# EAGLE design MTCH_bob (EAGLE 9.6.2)
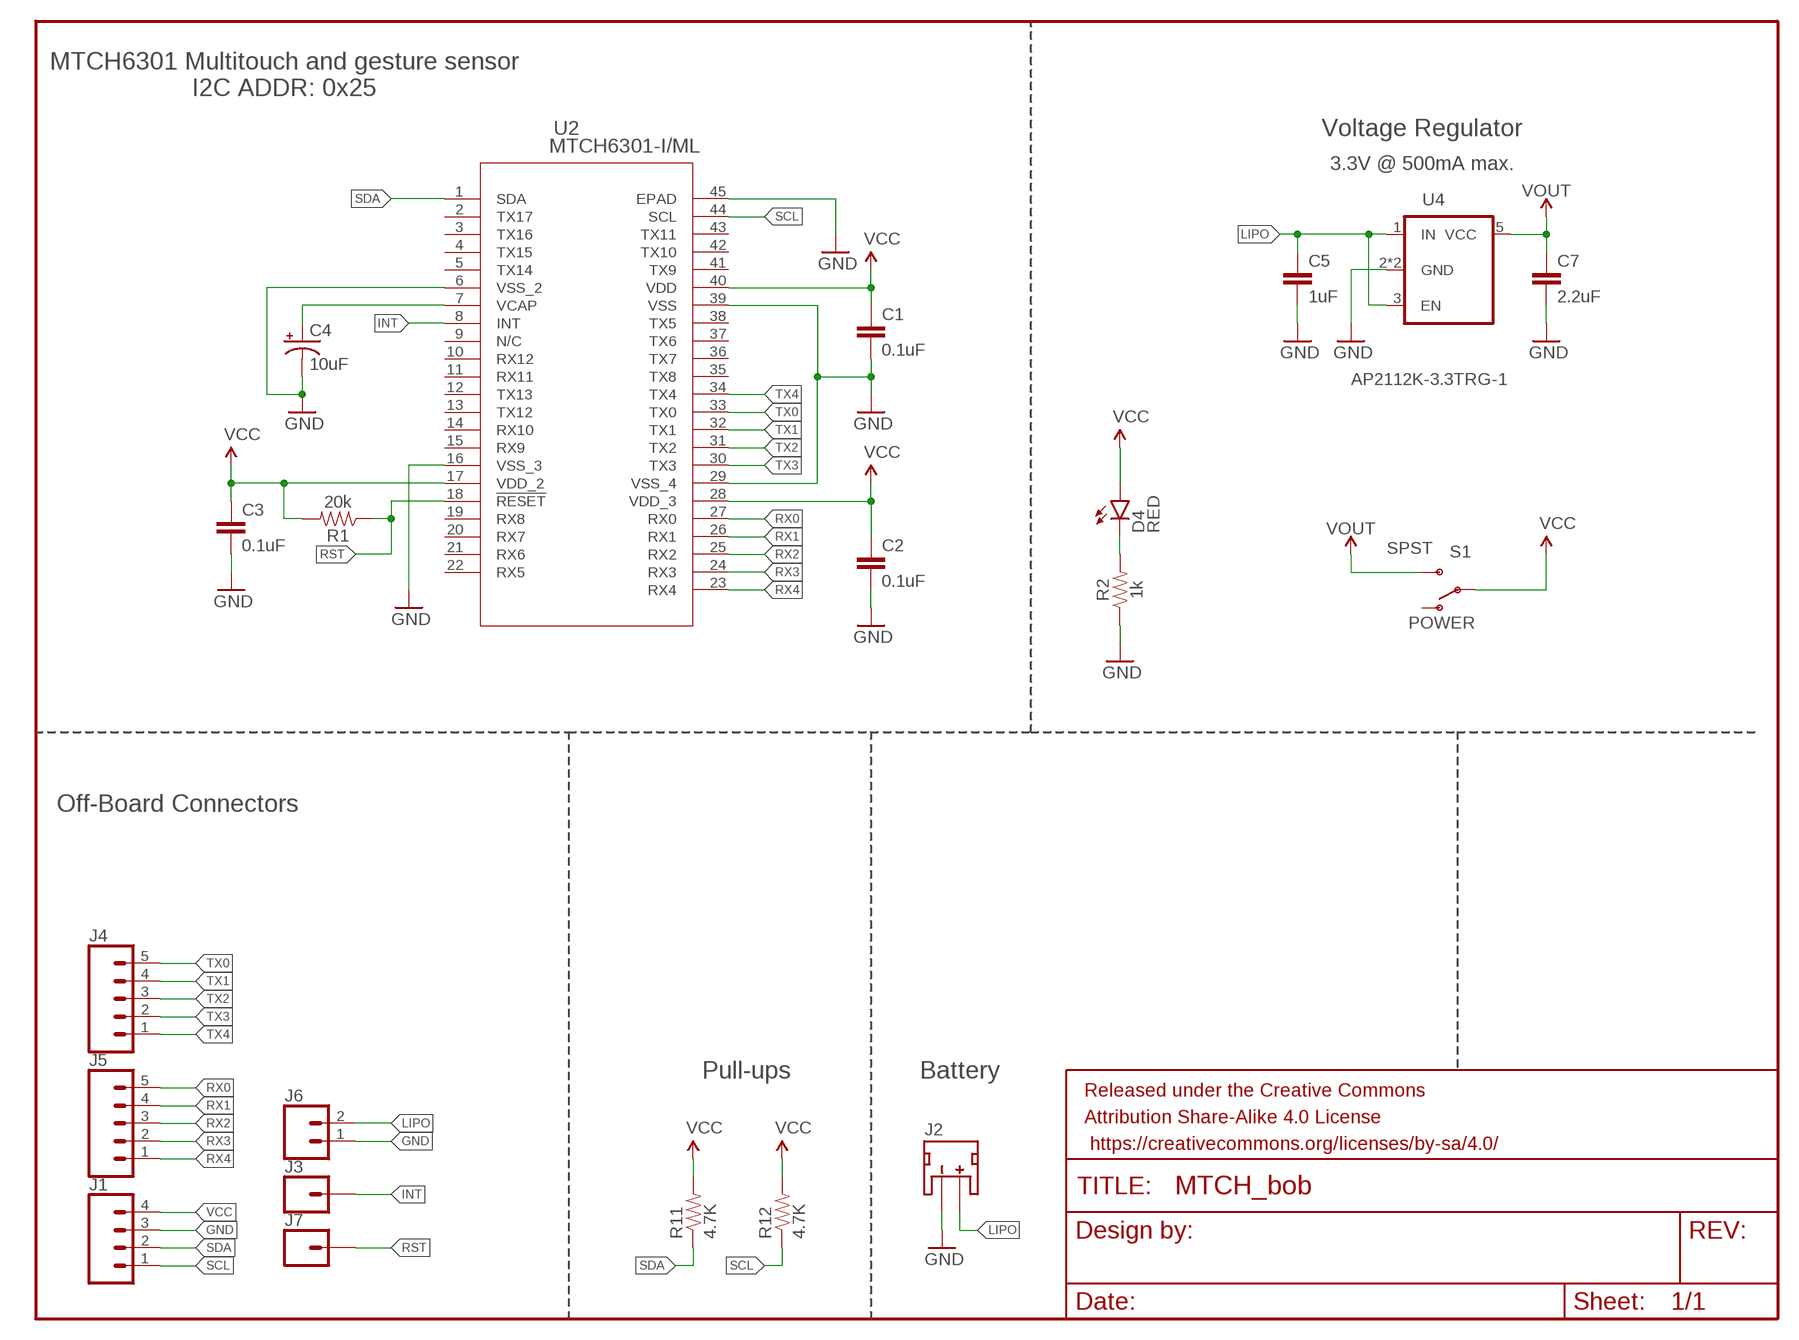
[diagram p0: schematic, sheet 1]

## Parts
C1  0.1uF  0.1UF-0603-25V-(+80/-20%)  [0603]
C2  0.1uF  0.1UF-0603-25V-(+80/-20%)  [0603]
C3  0.1uF  0.1UF-0603-25V-(+80/-20%)  [0603]
C4  10uF  10UF-POLAR-EIA3528-20V-10%(TANT)  [EIA3528]
C5  1uF  CAP0603-CAP  [0603-CAP]
C7  2.2uF  2.2UF-10V-20%(0603)  [0603-CAP]
D4  RED  LED-RED1206  [LED-1206]
FRAME1  FRAME-LETTERNO_PACKAGE  [DUMMY]
J1  CONN_04  [1X04]
J2  LiPo  JST_2MM_MALE  [JST-2-SMD]
J3  CONN_01  [1X01]
J4  CONN_05  [1X05]
J5  CONN_05  [1X05]
J6  CONN_02  [1X02]
J7  CONN_01  [1X01]
R1  20k  20KOHM-0603-1/10W-1%  [0603]
R2  1k  1KOHM-0603-1/10W-1%  [0603]
R11  4.7K  RESISTOR0603-RES  [0603-RES]
R12  4.7K  RESISTOR0603-RES  [0603-RES]
S1  POWER  SWITCH-SPDT-SMD-A  [SWITCH-SPST-SMD-A]
U2  MTCH6301-I/ML  [QFN44_8X8MC_MCH]
U4  AP2112K-3.3TRG-1  LDO-TPS78233  [SOT23-5]

## Nets
GND: C1.2 C2.2 C3.2 C4.C(-) C5.2 C7.2 J1.3 J2.1(-) J6.1 R2.1 U2.6(VSS_2) U2.16(VSS_3) U2.29(VSS_4) U2.39(VSS) U2.45(EPAD) U4.2(GND) U4.4(GND)
INT: J3.1 U2.8(INT)
LIPO: C5.1 J2.2(+) J6.2 U4.1(IN) U4.3(EN)
N$2: C4.A(+) U2.7(VCAP)
N$4: D4.C R2.2
RST: J7.1 R1.1 U2.18(!RESET)
RX0: J5.5 U2.27(RX0)
RX1: J5.4 U2.26(RX1)
RX2: J5.3 U2.25(RX2)
RX3: J5.2 U2.24(RX3)
RX4: J5.1 U2.23(RX4)
SCL: J1.1 R12.1 U2.44(SCL)
SDA: J1.2 R11.1 U2.1(SDA)
TX0: J4.5 U2.33(TX0)
TX1: J4.4 U2.32(TX1)
TX2: J4.3 U2.31(TX2)
TX3: J4.2 U2.30(TX3)
TX4: J4.1 U2.34(TX4)
VCC: C1.1 C2.1 C3.1 D4.A J1.4 R1.2 R11.2 R12.2 S1.2(P) U2.17(VDD_2) U2.28(VDD_3) U2.40(VDD)
VOUT: C7.1 S1.3(S) U4.5(VCC)
Unconnected: J2.NC1(PAD1) J2.NC2(PAD2) S1.1(O) U2.2(TX17) U2.3(TX16) U2.4(TX15) U2.5(TX14) U2.9(N/C) U2.10(RX12) U2.11(RX11) U2.12(TX13) U2.13(TX12) U2.14(RX10) U2.15(RX9) U2.19(RX8) U2.20(RX7) U2.21(RX6) U2.22(RX5) U2.35(TX8) U2.36(TX7) U2.37(TX6) U2.38(TX5) U2.41(TX9) U2.42(TX10) U2.43(TX11)

## Notes on the sheet
- MTCH6301 Multitouch and gesture sensor
  I2C ADDR: 0x25
- Voltage Regulator
- 3.3V @ 500mA max.
- SPST
- Off-Board Connectors
- Pull-ups | Battery

## Library data of the parts
C1-C3 = SparkFun-Capacitors:0.1UF: 0.1µF ceramic capacitors A capacitor is a passive two-terminal electrical component used to store electrical energy temporarily in an electric field.; PROD_ID: CAP-00810
C4 = SparkFun-Capacitors:10UF-POLAR: 10.0µF polarized capacitors A capacitor is a passive two-terminal electrical component used to store electrical energy temporarily in an electric field.; PROD_ID: CAP-08063
C5 = SparkFun-Passives:CAP: Capacitor Standard 0603 ceramic capacitor, and 0.1" leaded capacitor.; PROD_ID: CAP-00868
C7 = SparkFun-Capacitors:2.2UF-10V-20%(0603): CAP-07888; PROD_ID: CAP-07888
D4 = SparkFun-LED:LED-RED: Red SMD LED Used in manufacturing of most products at SparkFun Packages: 0603 - SMD 0603 package [Product Link] <http://docs.avagotech.com/docs/AV02-0551EN> 0603 SMART - SMD 0603 SMART package ( more efficient and expensive)[Product Link] <http://www.osram-os.com/Graphics/XPic2/00077099_0.pdf> 1206 - SMD1206 package [Product Link] <https://www.sparkfun.com/datasheets/DevTools/LilyPad/Q150OVS4.pdff> SparkFun Products: Pro Mini 328 -5V <https://www.sparkfun.com/products/821> RedBoard <https://www.sparkfun.com/products/12757> IOIO-OTG <https://www.sparkfun.com/products/13613>; PROD_ID: DIO-09912
FRAME1 = SparkFun-Aesthetics:FRAME-LETTER: Schematic Frame - Letter Standard 8.5x11 US Letter frame; DESIGNER: Nobody; VERSION: v01
J1 = SparkFun-Connectors:CONN_04: Multi connection point. Often used as Generic Header-pin footprint for 0.1 inch spaced/style header connections On any of the 0.1 inch spaced packages, you can populate with these: Break Away Headers - Straight <https://www.sparkfun.com/products/116> (PRT-00116) Break Away Male Headers - Right Angle <https://www.sparkfun.com/products/553> (PRT-00553) Female Headers <https://www.sparkfun.com/products/115> (PRT-00115) Break Away Headers - Machine Pin <https://www.sparkfun.com/products/117> (PRT-00117) Break Away Female Headers - Swiss Machine Pin <https://www.sparkfun.com/products/743> (PRT-00743) For SCREWTERMINALS and SPRING TERMINALS visit here: Screw Terimnals on SparkFun.com <https://www.sparkfun.com/search/results?term=Screw+Terminals> (5mm/3.5mm/2.54mm spacing) This device is also useful as a general connection point to wire up your design to another part of your project. Our various solder wires solder well into these plated through hole pads. Hook-Up Wire - Assortment (Stranded, 22 AWG) <https://www.sparkfun.com/products/11375> (PRT-11375) Hook-Up Wire - Assortment (Solid Core, 22 AWG) <https://www.sparkfun.com/products/11367> (PRT-11367) View the entire wire category on our website here <https://www.sparkfun.com/categories/141> Special notes: Molex polarized connector foot print use with SKU : PRT-08231 with associated crimp pins and housings. 1MM SMD Version SKU: PRT-10208; PROD_ID: CONN-09696
J2 = SparkFun-Connectors:JST_2MM_MALE: Mates to single-cell LiPo batteries. CONN-11443 Now with smashable polarity marks!; BTM_NEG: -; BTM_POS: +; PROD_ID: CONN-11443; TOP_NEG: -; TOP_POS: +
J3 J7 = SparkFun-Connectors:CONN_01: Single connection point. Often used as Generic Header-pin footprint for 0.1 inch spaced/style header connections On any of the 0.1 inch spaced packages, you can populate with these: Break Away Headers - Straight <https://www.sparkfun.com/products/116> (PRT-00116) Break Away Male Headers - Right Angle <https://www.sparkfun.com/products/553> (PRT-00553) Female Headers <https://www.sparkfun.com/products/115> (PRT-00115) Break Away Headers - Machine Pin <https://www.sparkfun.com/products/117> (PRT-00117) Break Away Female Headers - Swiss Machine Pin <https://www.sparkfun.com/products/743> (PRT-00743) This device is also useful as a general connection point to wire up your design to another part of your project. Our various solder wires solder well into these plated through hole pads. Hook-Up Wire - Assortment (Stranded, 22 AWG) <https://www.sparkfun.com/products/11375> (PRT-11375) Hook-Up Wire - Assortment (Solid Core, 22 AWG) <https://www.sparkfun.com/products/11367> (PRT-11367) View the entire wire category on our website here <https://www.sparkfun.com/categories/141> Special notes: SMTSO-256-ET is a "flush mount" nut for a 4-40 screw. We mostly use this on specialty testbeds; it is a nice way to connect hardware to your PCB at an adjustable hieght. Also note, the SNAP packages are for using a snappable style connector. We sell a baggie of snaps and they are also used on two LilyPad designs: Snap Assortment - 30 pack (male and female) <https://www.sparkfun.com/products/11347> (DEV-11347) LilyPad Arduino SimpleSnap <https://www.sparkfun.com/products/10941> (DEV-10941) LilyPad SimpleSnap Protoboard <https://www.sparkfun.com/products/10940> (DEV-10940)
J4 J5 = SparkFun-Connectors:CONN_05: Multi connection point. Often used as Generic Header-pin footprint for 0.1 inch spaced/style header connections On any of the 0.1 inch spaced packages, you can populate with these: Break Away Headers - Straight <https://www.sparkfun.com/products/116> (PRT-00116) Break Away Male Headers - Right Angle <https://www.sparkfun.com/products/553> (PRT-00553) Female Headers <https://www.sparkfun.com/products/115> (PRT-00115) Break Away Headers - Machine Pin <https://www.sparkfun.com/products/117> (PRT-00117) Break Away Female Headers - Swiss Machine Pin <https://www.sparkfun.com/products/743> (PRT-00743) For SCREWTERMINALS and SPRING TERMINALS visit here: Screw Terimnals on SparkFun.com <https://www.sparkfun.com/search/results?term=Screw+Terminals> (5mm/3.5mm/2.54mm spacing) This device is also useful as a general connection point to wire up your design to another part of your project. Our various solder wires solder well into these plated through hole pads. Hook-Up Wire - Assortment (Stranded, 22 AWG) <https://www.sparkfun.com/products/11375> (PRT-11375) Hook-Up Wire - Assortment (Solid Core, 22 AWG) <https://www.sparkfun.com/products/11367> (PRT-11367) View the entire wire category on our website here <https://www.sparkfun.com/categories/141> Special notes: Molex polarized connector foot print use with SKU : PRT-08231 with associated crimp pins and housings. 1MM SMD Version SKU: PRT-10208
J6 = SparkFun-Connectors:CONN_02: Multi connection point. Often used as Generic Header-pin footprint for 0.1 inch spaced/style header connections On any of the 0.1 inch spaced packages, you can populate with these: Break Away Headers - Straight <https://www.sparkfun.com/products/116> (PRT-00116) Break Away Male Headers - Right Angle <https://www.sparkfun.com/products/553> (PRT-00553) Female Headers <https://www.sparkfun.com/products/115> (PRT-00115) Break Away Headers - Machine Pin <https://www.sparkfun.com/products/117> (PRT-00117) Break Away Female Headers - Swiss Machine Pin <https://www.sparkfun.com/products/743> (PRT-00743) For SCREWTERMINALS and SPRING TERMINALS visit here: Screw Terimnals on SparkFun.com <https://www.sparkfun.com/search/results?term=Screw+Terminals> (5mm/3.5mm/2.54mm spacing) This device is also useful as a general connection point to wire up your design to another part of your project. Our various solder wires solder well into these plated through hole pads. Hook-Up Wire - Assortment (Stranded, 22 AWG) <https://www.sparkfun.com/products/11375> (PRT-11375) Hook-Up Wire - Assortment (Solid Core, 22 AWG) <https://www.sparkfun.com/products/11367> (PRT-11367) View the entire wire category on our website here <https://www.sparkfun.com/categories/141> Special notes: Molex polarized connector foot print use with: PRT-08233 with associated crimp pins and housings. 2.54_SCREWTERM for use with PRT-10571. 3.5mm Screw Terminal footprints for PRT-08084 5mm Screw Terminal footprints for use with PRT-08432
R1 = SparkFun-Resistors:20KOHM: 20kΩ resistor A resistor is a passive two-terminal electrical component that implements electrical resistance as a circuit element. Resistors act to reduce current flow, and, at the same time, act to lower voltage levels within circuits. - Wikipedia; PROD_ID: RES-09383
R2 = SparkFun-Resistors:1KOHM: 1kΩ resistor A resistor is a passive two-terminal electrical component that implements electrical resistance as a circuit element. Resistors act to reduce current flow, and, at the same time, act to lower voltage levels within circuits. - Wikipedia; PROD_ID: RES-07856
R11 R12 = SparkFun-Passives:RESISTOR: Resistor Basic schematic elements and footprints for 0603, 1206, and PTH resistors.; PROD_ID: RES-07857
S1 = SparkFun-Electromechanical:SWITCH-SPDT: SPDT Switch Simple slide switch, Spark Fun Electronics SKU : COM-00102 DPDT SMT slide switch, AYZ0202, SWCH-08179; PROD_ID: SWCH-10651
U2 = MTCH6301:MTCH6301-I/ML; COPYRIGHT: Copyright (C) 2021 Ultra Librarian. All rights reserved.; DIGI-KEY_PART_NUMBER_1: MTCH6301-I/ML-ND; MANUFACTURER_PART_NUMBER: MTCH6301-I/ML; MFR_NAME: Microchip
U4 = SparkFun-PowerIC:LDO-TPS78233: Voltage Regulator LDO 500nA Ground Current, 150mA, Ultra-Low Quiescent Current Low-Dropout Linear Regulator.; PROD_ID: VREG-12457

## Board
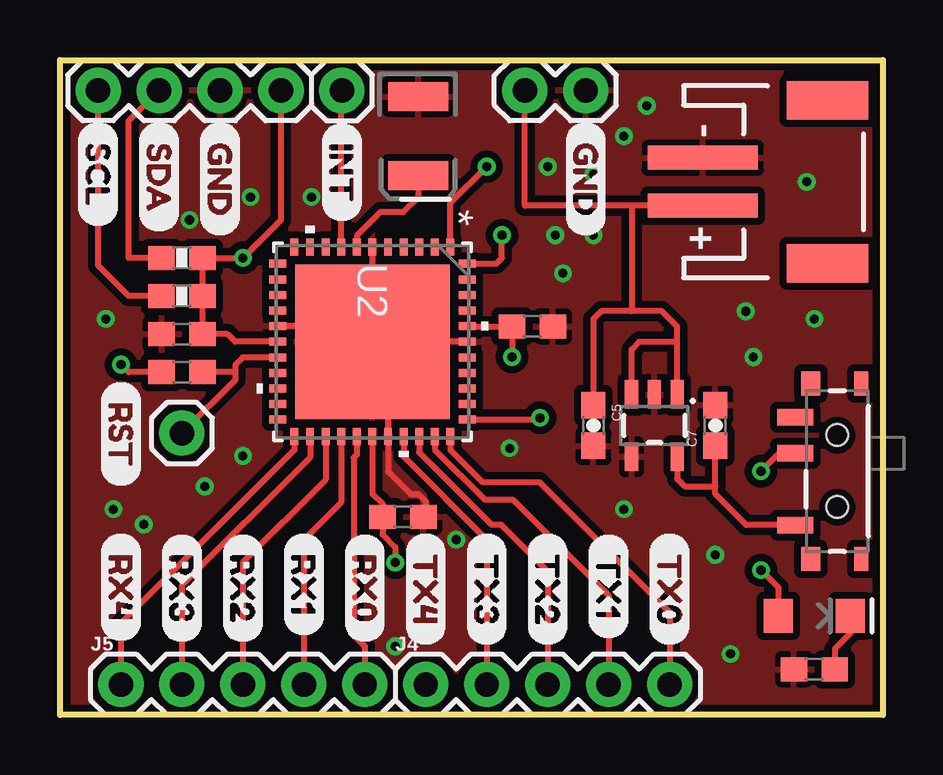
[diagram p1: board, top side]
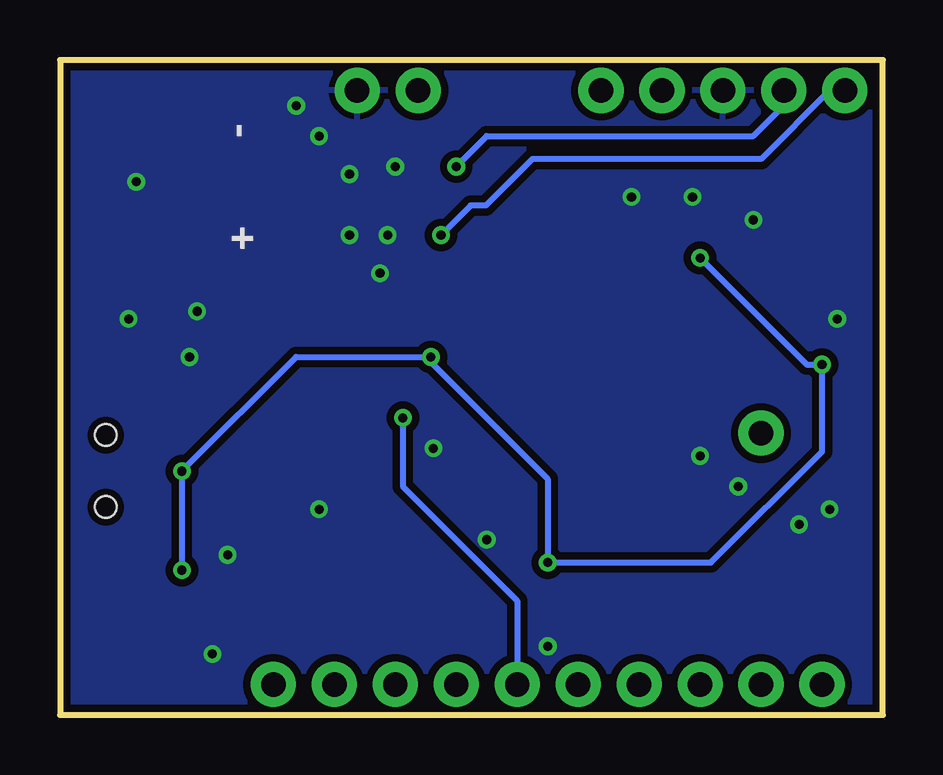
[diagram p2: board, bottom side, seen from below]

Size 34.29 x 27.3 mm. Coordinates in mm from the lower left corner, seen from the top.
Outline: 0,0 0,27.3 34.29,27.3 34.29,0 0,0
Copper layers (1*16): Top 0.035mm / dielectric 1.5mm / Bottom 0.035mm
Design rules "SparkFun-2-layer-TIGHT": minimum track width 7mil, minimum drill 15mil, track to track 7mil, track to pad 7mil, pad to pad 7mil, via to via 7mil, smd to smd 7mil, copper to edge 7mil, drill to drill 7mil, minimum pad ring 7mil, minimum via ring 7mil, stop-mask expansion 4mil, vias tented up to drill 25mil, thermal gap 10mil

### Footprints (pad centres in the part's own frame; a part is rotated, then mirrored left to right if it is on the bottom)
0603 = smd 1.1 x 1: 1 -0.85,0; 2 0.85,0
EIA3528 = smd 1.2 x 2.5: A 1.65,0; C -1.65,0
0603-CAP = smd 1.1 x 1: 1 -0.85,0; 2 0.85,0
LED-1206 = smd 1.2 x 1.4: A -1.5,0; C 1.5,0
1X04 = drill 1.016 pad 1.88: 1 0,0; 2 2.54,0; 3 5.08,0; 4 7.62,0
JST-2-SMD = smd 1 x 4.6: 1 -1,-3.7; 2 1,-3.7 | smd 1.6 x 3.4: NC1 -3.4,1.5; NC2 3.4,1.5
1X01 = drill 1.016 pad 1.88: 1 0,0
1X05 = drill 1.016 pad 1.88: 1 0,0; 2 2.54,0; 3 5.08,0; 4 7.62,0; 5 10.16,0
1X02 = drill 1.016 pad 1.88: 1 0,0; 2 2.54,0
0603-RES = smd 1.1 x 1: 1 -0.85,0; 2 0.85,0
SWITCH-SPST-SMD-A = smd 0.7 x 1.5: 1 -2.25,-1.75; 2 -0.75,-1.75; 3 2.25,-1.75 | smd 1 x 0.6: GND1 -3.65,1; GND3 3.65,1 | smd 1 x 0.8: GND2 -3.65,-1.1; GND4 3.65,-1.1 | hole 0.9: -1.5,0; 1.5,0
QFN44_8X8MC_MCH = smd 0.711 x 0.33: 1 -3.95,3.25; 2 -3.95,2.6; 3 -3.95,1.95; 4 -3.95,1.3; 5 -3.95,0.65; 6 -3.95,0; 7 -3.95,-0.65; 8 -3.95,-1.3; 9 -3.95,-1.95; 10 -3.95,-2.6; 11 -3.95,-3.25; 23 3.95,-3.25; 24 3.95,-2.6; 25 3.95,-1.95; 26 3.95,-1.3; 27 3.95,-0.65; 28 3.95,0; 29 3.95,0.65; 30 3.95,1.3; 31 3.95,1.95; 32 3.95,2.6; 33 3.95,3.25 | smd 0.33 x 0.711: 12 -3.25,-3.95; 13 -2.6,-3.95; 14 -1.95,-3.95; 15 -1.3,-3.95; 16 -0.65,-3.95; 17 0,-3.95; 18 0.65,-3.95; 19 1.3,-3.95; 20 1.95,-3.95; 21 2.6,-3.95; 22 3.25,-3.95; 34 3.25,3.95; 35 2.6,3.95; 36 1.95,3.95; 37 1.3,3.95; 38 0.65,3.95; 39 0,3.95; 40 -0.65,3.95; 41 -1.3,3.95; 42 -1.95,3.95; 43 -2.6,3.95; 44 -3.25,3.95 | smd 6.452 x 6.452: 45 0,0
SOT23-5 = smd 0.55 x 1.2: 1 -0.95,-1.3; 2 0,-1.3; 3 0.95,-1.3; 4 0.95,1.3; 5 -0.95,1.3

### Placement (x,y rotation side)
C1  14.29,8.26 0 top
C2  19.68,16.19 0 top
C3  5.08,15.88 180 top
C4  14.92,24.13 270 top
C5  22.23,12.06 270 top
C7  27.3,12.06 90 top
D4  31.43,4.13 0 top
FRAME1  -36.83,34.29 0 top  (outside the outline)
J1  1.59,26.04 0 top
J2  30.48,22.23 270 top
J3  11.75,26.04 0 top
J4  15.24,1.27 0 top
J5  2.54,1.27 0 top
J6  21.91,26.04 180 top
J7  5.08,11.75 0 top
R1  5.08,14.29 180 top
R2  31.43,1.91 0 top
R11  5.08,19.05 0 top
R12  5.08,17.46 0 top
S1  32.38,10.16 270 top
U2  13.02,15.56 270 top
U4  24.77,12.06 180 top
U$1  [GND0]  6.67,24.77 270 top
U$2  [INT12]  11.75,24.77 270 top
U$3  [RST15]  2.54,13.97 270 top
U$4  [RX07]  12.7,7.62 270 top
U$5  [RX18]  10.16,7.62 270 top
U$6  [RX29]  7.62,7.62 270 top
U$7  [RX310]  5.08,7.62 270 top
U$8  [RX411]  2.54,7.62 270 top
U$9  [SCL14]  1.59,24.77 270 top
U$10  [SDA13]  4.13,24.77 270 top
U$11  [TX02]  25.4,7.62 270 top
U$12  [TX13]  22.86,7.62 270 top
U$14  [TX35]  17.78,7.62 270 top
U$15  [TX46]  15.24,7.62 270 top
U$16  [GND0]  21.91,24.77 270 top
U$17  [TX24]  20.32,7.62 270 top

### Tracks (layer width: path | path; a pad name or v marks a point on that pad's centre or on a via)
GND  (via drill 0.38)
  Top 0.254: U2.29 13.67,14.91 13.18,15.4 | 13.18,15.4 U2.45 | U2.29 13.67,13.98 13.97,14.29 | U2.16 12.37,16.21 U2.45 | U2.6 U2.45 | U2.39 15.7,15.56 15.54,15.4 13.18,15.4 | U2.29 13.67,10.14 14.61,9.21 14.92,9.21 15.24,8.89 15.24,8.36 C1.2
  other vias: 16.51,7.3 18.73,11.11 20.95,18.41 28.57,16.83 31.11,22.23 23.5,24.13 22.23,22.54 20.64,20 10.48,21.59 7.94,21.59 5.4,20.64 1.91,16.51 7.62,10.79 2.22,8.57 23.5,8.57 27.3,6.67 27.94,2.54 28.89,14.92 31.43,16.51 20.32,22.86 22.23,20 24.45,25.4 13.97,2.86 3.49,7.94 6.03,9.53
  pour Top (isolate 0.305): 0,0 0,27.3 34.29,27.3 34.29,0
  pour Bottom (isolate 0.305): 0,0 0,27.3 34.29,27.3 34.29,0
INT
  Top 0.254: U2.8 11.72,26 J3.1
LIPO
  Top 0.254: J2.2 23.81,21.23 | 23.81,21.23 19.37,21.23 J6.2 | U4.1 25.71,15.56 | 25.71,15.56 25.71,16.2 25.08,16.83 23.81,16.83 | 23.81,16.83 22.54,16.83 22.23,16.51 C5.1 | 23.81,21.23 23.81,16.83 | U4.3 23.81,15.24 24.13,15.56 25.71,15.56
N$2
  Top 0.178: 14.86,22.48 C4.A
  Top 0.254: U2.7 12.37,19.99 13.34,20.95 14.29,20.95 14.92,21.59 C4.A
N$4
  Top 0.254: D4.C 32.93,3.4 32.28,2.75 R2.2
RST
  Top 0.254: U2.18 7.61,14.91 7.3,14.61 7.3,14.29 | 7.3,14.29 R1.1 | 7.3,14.29 7.3,13.97 J7.1
RX0
  Top 0.254: U2.27 12.37,10.85 12.24,10.72 12.24,3.32 12.7,2.86 J5.5
RX1
  Top 0.254: U2.26 11.72,8.86 10.16,7.3 J5.4
RX2
  Top 0.254: U2.25 11.07,9.8 7.62,6.35 J5.3
RX3
  Top 0.254: U2.24 10.42,10.73 5.08,5.4 J5.2
RX4
  Top 0.254: U2.23 9.77,11.04 2.54,3.81 J5.1
SCL  (via drill 0.38)
  Top 0.254: R12.1 2.86,17.46 1.59,18.73 J1.1 | U2.44 18.17,18.81 18.41,19.05 v18.41,20
  Bottom 0.254: J1.1 2.22,26.04 5.08,23.18 14.61,23.18 16.55,21.23 17.18,21.23 v18.41,20
SDA  (via drill 0.38)
  Top 0.254: R11.1 2.86,19.05 2.86,24.77 J1.2 | U2.1 16.27,21.35 v17.78,22.86
  Bottom 0.254: v17.78,22.86 16.51,24.13 5.4,24.13 4.13,25.4 J1.2
TX0
  Top 0.254: U2.33 16.27,11.04 17.6,9.7 19.98,9.7 25.4,4.28 J4.5
TX1
  Top 0.254: U2.32 15.62,11.05 17.69,8.98 18.86,8.98 22.86,4.98 J4.4
TX2
  Top 0.254: J4.3 20.32,5.99 18.37,7.94 17.98,7.94 14.97,10.95 U2.31
TX3
  Top 0.254: U2.30 14.32,10.77 17.78,7.3 J4.2
TX4  (via drill 0.38)
  Top 0.254: U2.34 19.93,12.31 v20,12.38
  Bottom 0.254: v20,12.38 20,9.53 15.24,4.76 J4.1
VCC  (via drill 0.38)
  Top 0.254: S1.2 29.96,10.91 v29.21,10.16 | U2.40 16.98,16.19 C2.1 v18.84,14.92 | U2.17 7.3,15.56 6.99,15.88 C3.1 R12.2 R11.2 v7.62,19.05 9.21,20.64 J1.4 | R1.2 2.86,14.29 v2.54,14.61 | U2.28 13.02,9.21 13.44,8.79 C1.1 13.44,7.52 13.97,6.99 v13.97,6.35 | v29.21,6.03 29.93,5.31 D4.A
  Bottom 0.254: v29.21,6.03 v29.21,10.16 24.45,14.92 v18.84,14.92 18.84,14.71 13.97,9.84 v13.97,6.35 7.17,6.35 2.54,10.98 v2.54,14.61 3.17,14.61 v7.62,19.05
VOUT
  Top 0.254: S1.3 28.6,7.91 27.3,9.21 27.3,9.53 | 27.3,9.53 C7.1 | U4.5 25.72,9.84 26.04,9.53 27.3,9.53